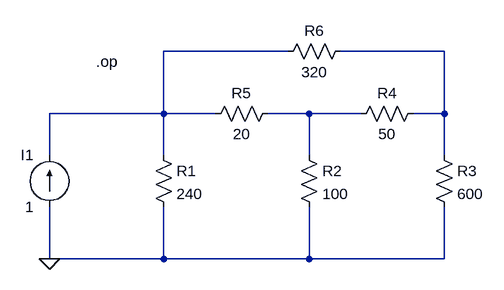
[diagram p0: schematic Lab07P01D.asc]
Lab07P01D.asc, the LTspice schematic file:
Version 4
SHEET 1 4480 680
WIRE 480 -32 288 -32
WIRE 720 -32 560 -32
WIRE 288 64 288 -32
WIRE 288 64 112 64
WIRE 368 64 288 64
WIRE 512 64 448 64
WIRE 592 64 512 64
WIRE 720 64 720 -32
WIRE 720 64 672 64
WIRE 112 128 112 64
WIRE 288 128 288 64
WIRE 512 128 512 64
WIRE 720 128 720 64
WIRE 112 288 112 208
WIRE 288 288 288 208
WIRE 288 288 112 288
WIRE 512 288 512 208
WIRE 512 288 288 288
WIRE 720 288 720 208
WIRE 720 288 512 288
FLAG 112 288 0
DATAFLAG 112 64 ""
SYMBOL current 112 208 R180
WINDOW 0 24 80 Left 2
WINDOW 3 24 0 Left 2
SYMATTR InstName I1
SYMATTR Value 1
SYMBOL res 272 112 R0
SYMATTR InstName R1
SYMATTR Value 240
SYMBOL res 496 112 R0
SYMATTR InstName R2
SYMATTR Value 100
SYMBOL res 704 112 R0
SYMATTR InstName R3
SYMATTR Value 600
SYMBOL res 688 48 R90
WINDOW 0 0 56 VBottom 2
WINDOW 3 32 56 VTop 2
SYMATTR InstName R4
SYMATTR Value 50
SYMBOL res 464 48 R90
WINDOW 0 0 56 VBottom 2
WINDOW 3 32 56 VTop 2
SYMATTR InstName R5
SYMATTR Value 20
SYMBOL res 576 -48 R90
WINDOW 0 0 56 VBottom 2
WINDOW 3 32 56 VTop 2
SYMATTR InstName R6
SYMATTR Value 320
TEXT 184 -16 Left 2 !.op

The netlist it stands for:
* Lab07P01D.asc
I1 0 N001 1
R1 N001 0 240
R2 N003 0 100
R3 N002 0 600
R4 N002 N003 50
R5 N003 N001 20
R6 N002 N001 320
.op
.backanno
.end